# Altium schematic sheet DASH_V_3_LEDS_POWER.SchDoc
size A
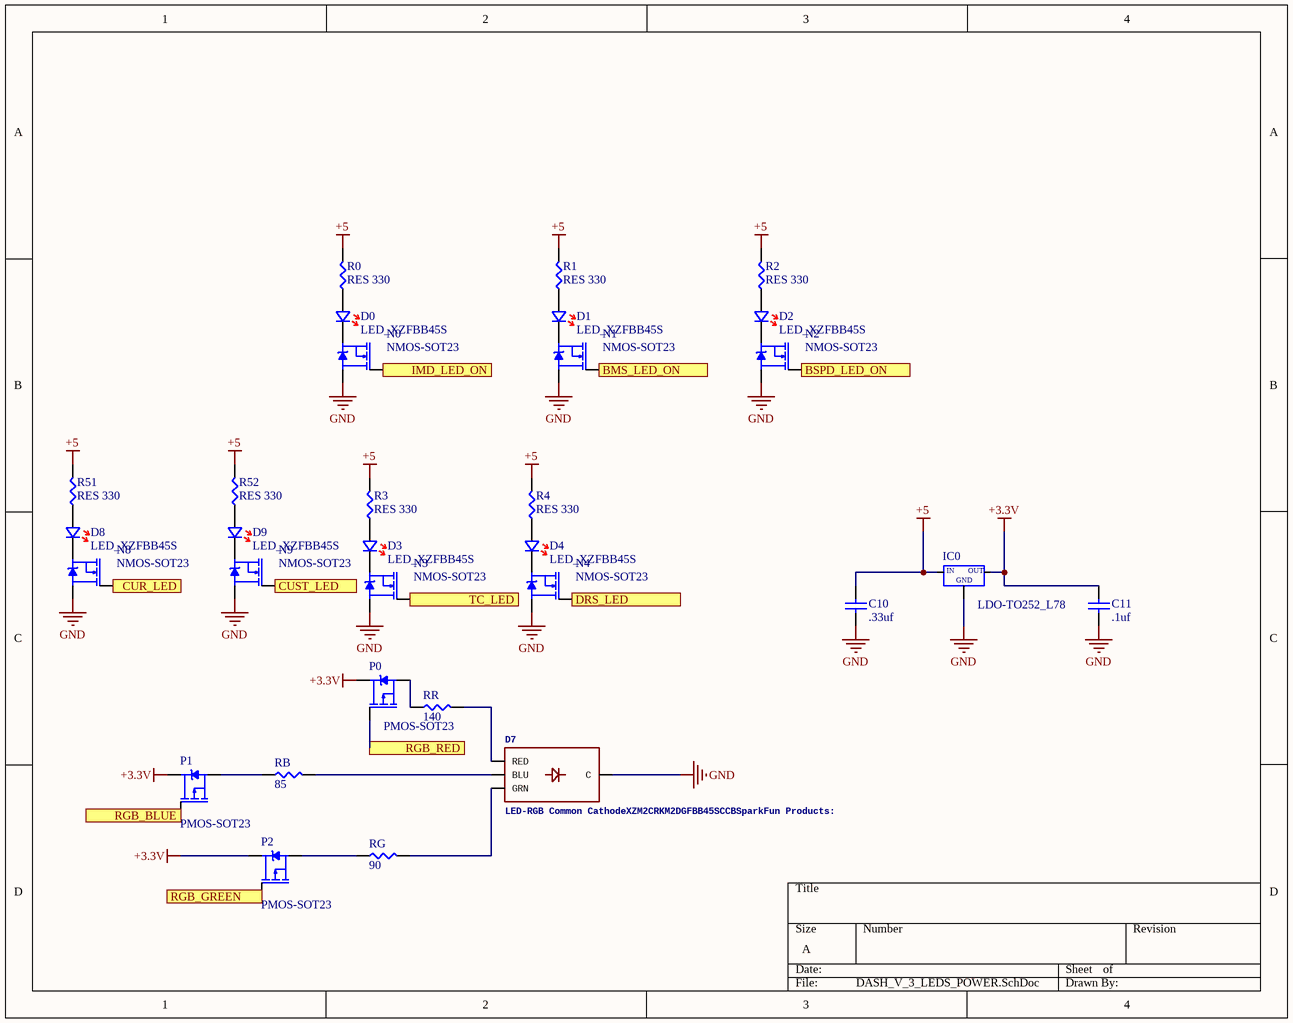
[diagram p0: DASH_V_3_LEDS_POWER.SchDoc]

## Parts
C10  .33uf  [CAPC1608X87X35NL15T15]
C11  .1uf  [CAPC1608X87X35NL15T15]
D0  LED_XZFBB45S  [LED_XZFBB45S]
D1  LED_XZFBB45S  [LED_XZFBB45S]
D2  LED_XZFBB45S  [LED_XZFBB45S]
D3  LED_XZFBB45S  [LED_XZFBB45S]
D4  LED_XZFBB45S  [LED_XZFBB45S]
D7  LED-RGB Common CathodeXZM2CRKM2DGFBB45SCCBSparkFun Products:  [PLCC4SMDLED]
D8  LED_XZFBB45S  [LED_XZFBB45S]
D9  LED_XZFBB45S  [LED_XZFBB45S]
IC0  LDO-TO252_L78  [TO252]
N0  NMOS-SOT23  [SOT23]
N1  NMOS-SOT23  [SOT23]
N2  NMOS-SOT23  [SOT23]
N3  NMOS-SOT23  [SOT23]
N4  NMOS-SOT23  [SOT23]
N8  NMOS-SOT23  [SOT23]
N9  NMOS-SOT23  [SOT23]
P0  PMOS-SOT23  [SOT23]
P1  PMOS-SOT23  [SOT23]
P2  PMOS-SOT23  [SOT23]
R0  RES 330  [RES-0603]
R1  RES 330  [RES-0603]
R2  RES 330  [RES-0603]
R3  RES 330  [RES-0603]
R4  RES 330  [RES-0603]
R51  RES 330  [RES-0603]
R52  RES 330  [RES-0603]
RB  85  [RES-0603]
RG  90  [RES-0603]
RR  140  [RES-0603]

## Ports
BMS_LED_ON, BSPD_LED_ON, CUR_LED, CUST_LED, DRS_LED, IMD_LED_ON, RGB_BLUE, RGB_GREEN, RGB_RED, TC_LED

## Nets
+3.3V: C11.2 IC0.3 P0.2(S) P1.2(S) P2.2(S)
+5: C10.2 IC0.1 R0.2 R1.2 R2.2 R3.2 R4.2 R51.2 R52.2
GND: C10.1 C11.1 D7.4(C) IC0.2 N0.2(S) N1.2(S) N2.2(S) N3.2(S) N4.2(S) N8.2(S) N9.2(S)
BMS_LED_ON: N1.1(G) ; port BMS_LED_ON
BSPD_LED_ON: N2.1(G) ; port BSPD_LED_ON
CUR_LED: N8.1(G) ; port CUR_LED
CUST_LED: N9.1(G) ; port CUST_LED
DRS_LED: N4.1(G) ; port DRS_LED
IMD_LED_ON: N0.1(G) ; port IMD_LED_ON
RGB_BLUE: P1.1(G) ; port RGB_BLUE
RGB_GREEN: P2.1(G) ; port RGB_GREEN
RGB_RED: P0.1(G) ; port RGB_RED
TC_LED: N3.1(G) ; port TC_LED
NetD0_A: D0.A R0.1
NetD0_K: D0.K N0.3(D)
NetD1_A: D1.A R1.1
NetD1_K: D1.K N1.3(D)
NetD2_A: D2.A R2.1
NetD2_K: D2.K N2.3(D)
NetD3_A: D3.A R3.1
NetD3_K: D3.K N3.3(D)
NetD4_A: D4.A R4.1
NetD4_K: D4.K N4.3(D)
NetD7_1: D7.1(RED) RR.2
NetD7_2: D7.2(GRN) RG.2
NetD7_3: D7.3(BLU) RB.2
NetD8_A: D8.A R51.1
NetD8_K: D8.K N8.3(D)
NetD9_A: D9.A R52.1
NetD9_K: D9.K N9.3(D)
NetP0_3: P0.3(D) RR.1
NetP1_3: P1.3(D) RB.1
NetP2_3: P2.3(D) RG.1

## Notes on the sheet
- (in symbol LDO-TO252_L78) IN; OUT; GND

## Library data of the parts
C10 C11 = CMP-2006-03887-1: .1 uf; Part Number: C0603C104J3RAC7867; Manufacturer: Kemet
D7 = SUNLEDSMD1: GateName_1: G1; SymbolName_1: LED-RGB-CC; DeviceName: SMD1; DeviceSetName: SUNLED; PROD_ID: DIO-13722; LibraryName: SparkFun-LED; Package: PLCC4SMDLED
R0-R4 R51 R52 RB RG RR = RES-0603